# Altium project Van Battery Controller V1.PrjPCB (part 3 of 3)

## Sheet [07] - GIGAVAC.SchDoc: GIGAVAC
size 433 x 279 mm; Author: ZAG; DrawnBy: ZAG; DocumentNumber: 5; SheetNumber: 7; SheetTotal: 8; PageSetup: Record=PageOptions|CenterHorizontal=True|CenterVertical=True|PrintScale=0.96|XCorrection=1.00|YCorrection=1.00|PrintKind=2|BorderSize=5000000|LeftOffset=0|BottomOffset=0|Orientation=2|PaperLength=4318|PaperWidth=2794|Scale=100|PaperSource=15|PrintQuality=600|MediaType=1|DitherType=10|PaperKind=11x17|PrintScaleMode=1; PCBRevision: 01; SchRevision: 01; Project: VAN BATT CTRLR V1; SchStatus: PRELIM
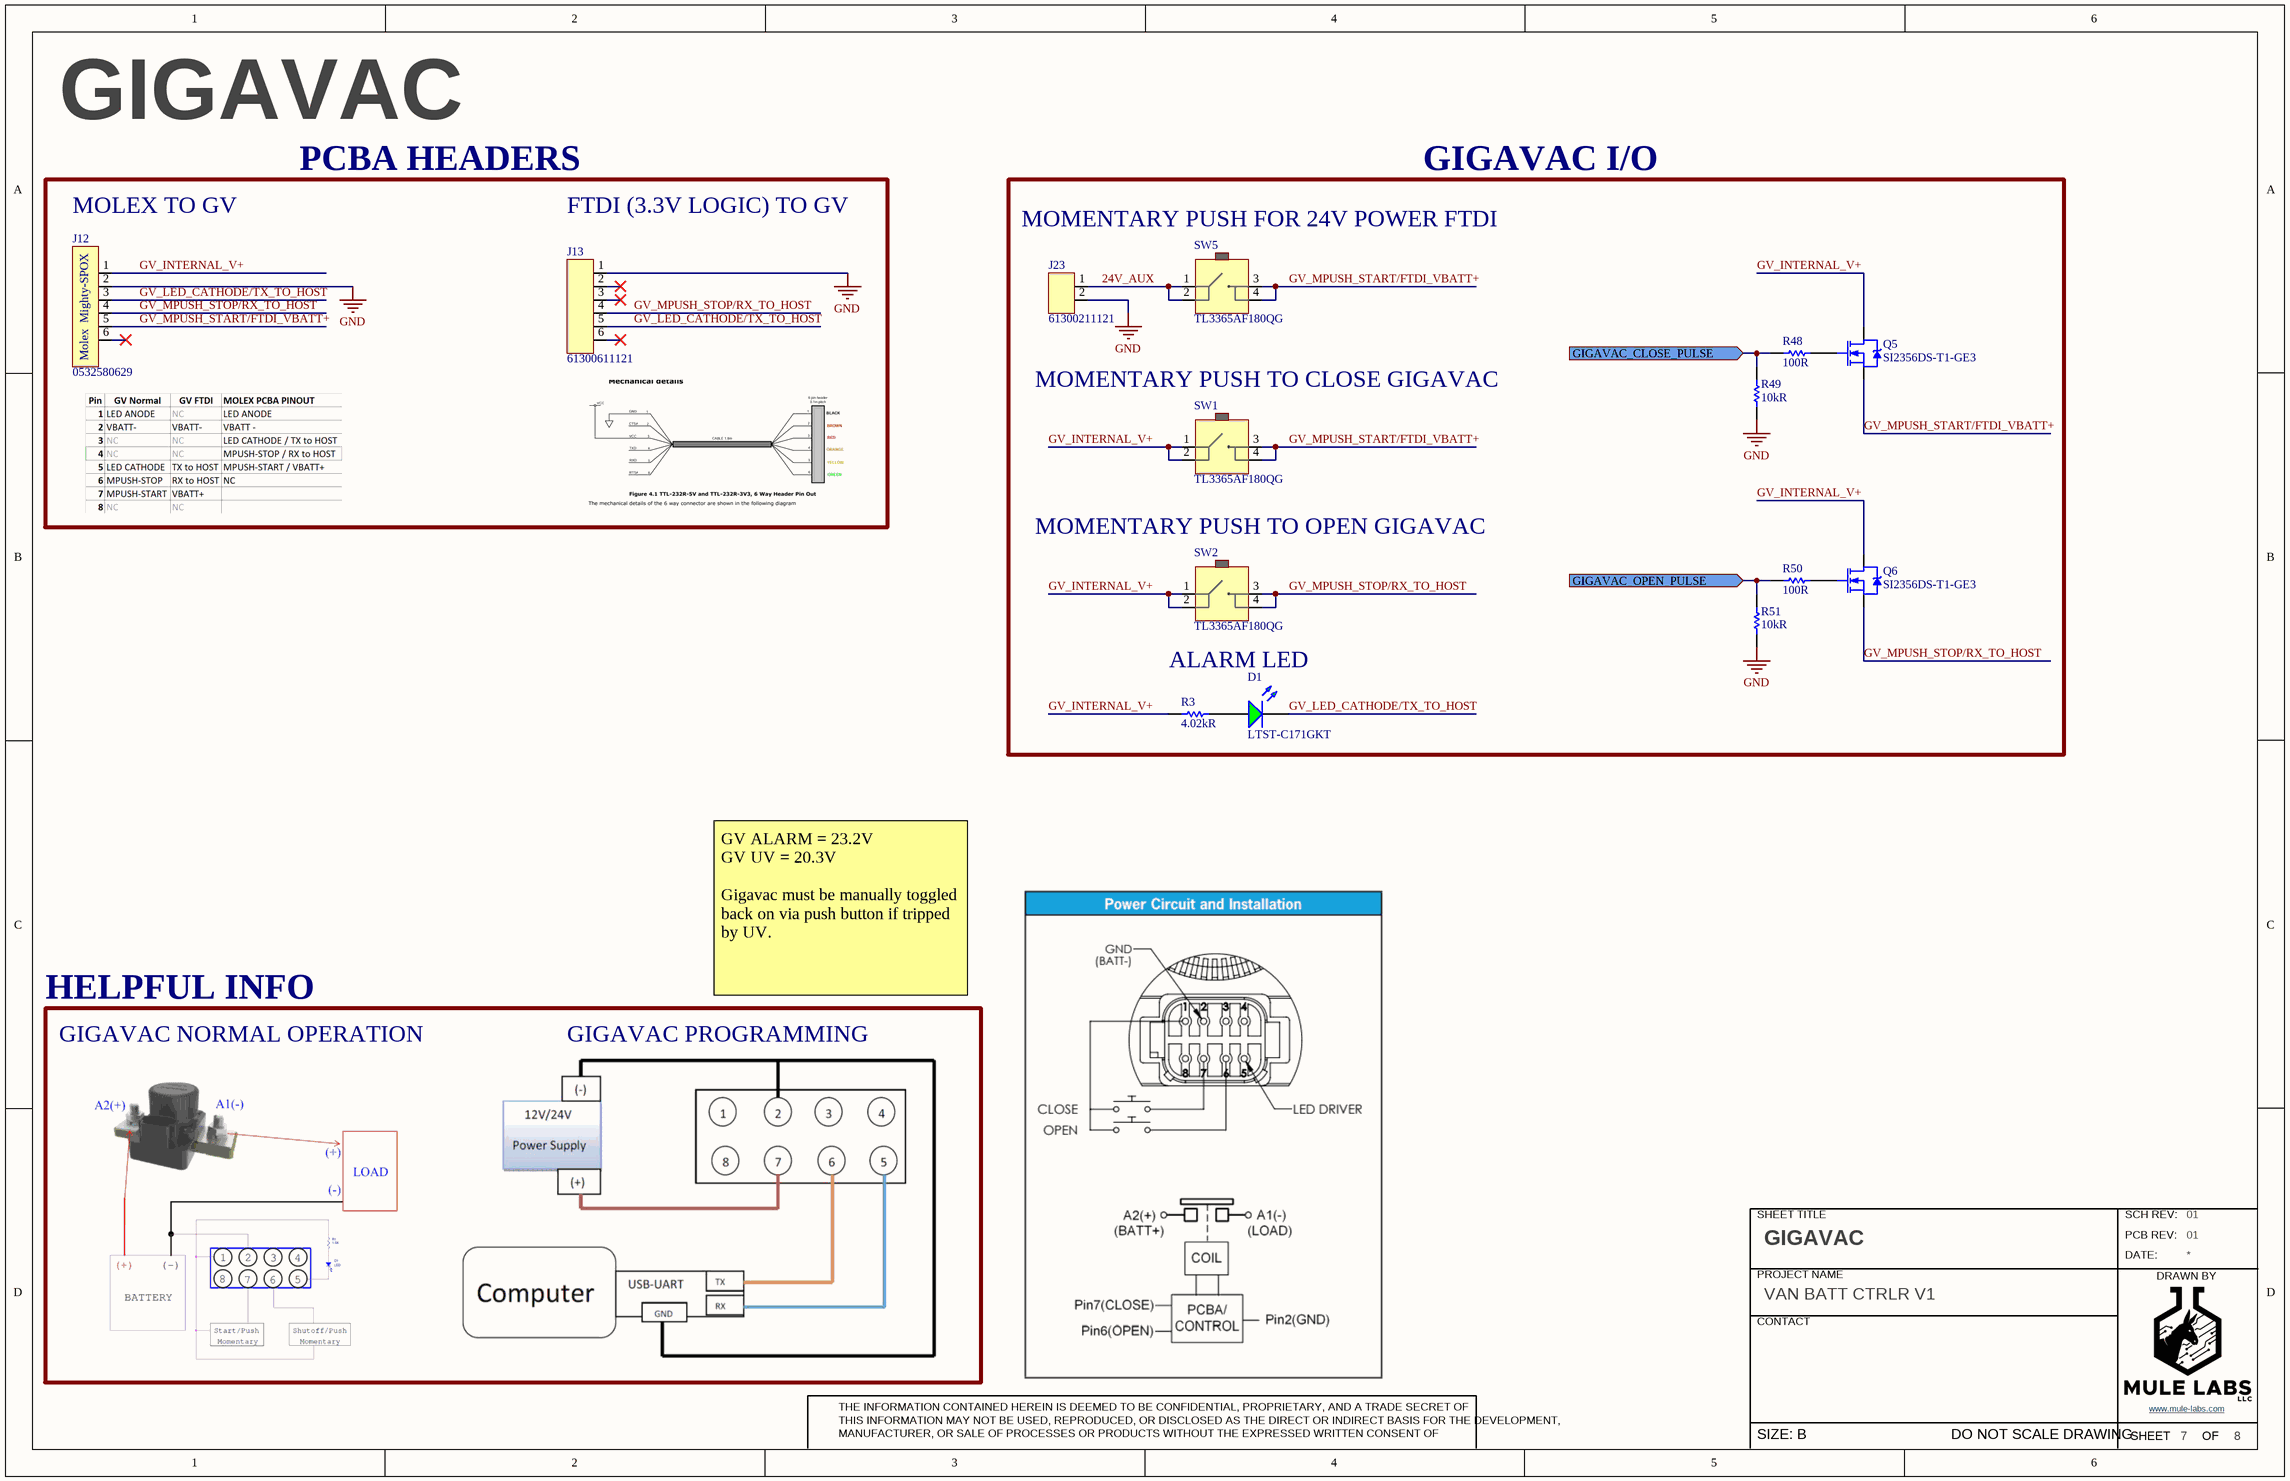
[diagram p6: [07] - GIGAVAC.SchDoc]

### Parts
D1  LTST-C171GKT  [LED - 0805 - GREEN]
J12  0532580629  [MOLEX_532580629]
J13  61300611121  [WURTH_61300611121]
J23  61300211121  [WURTH_61300211121]
Q5  SI2356DS-T1-GE3  [SOT23-3P95_237X112L50X42N]
Q6  SI2356DS-T1-GE3  [SOT23-3P95_237X112L50X42N]
R3  4.02kR  [INCH 0805 - METRIC 2012 - H065]
R48  100R  [INCH 0603 - METRIC 1608 - H055]
R49  10kR  [INCH 0603 - METRIC 1508 - H050]
R50  100R  [INCH 0603 - METRIC 1608 - H055]
R51  10kR  [INCH 0603 - METRIC 1508 - H050]
SW1  TL3365AF180QG  [ESWITCH_TL3365AF180QG]
SW2  TL3365AF180QG  [ESWITCH_TL3365AF180QG]
SW5  TL3365AF180QG  [ESWITCH_TL3365AF180QG]

### Blocks framed on the sheet
PCBA HEADERS: J12 J13
GIGAVAC I/O: D1 J23 Q5 Q6 R3 R48-R51 SW1 SW2 SW5

### Ports
GIGAVAC_CLOSE_PULSE (in), GIGAVAC_OPEN_PULSE (in)

### Nets
GND: J12.2 J13.1 J23.2 R49.1 R51.1
24V_AUX: J23.1 SW5.1 SW5.2
GIGAVAC_CLOSE_PULSE: R48.1 R49.2 ; port GIGAVAC_CLOSE_PULSE
GIGAVAC_OPEN_PULSE: R50.1 R51.2 ; port GIGAVAC_OPEN_PULSE
GV_INTERNAL_V+: J12.1 Q5.3(D) Q6.3(D) R3.1 SW1.1 SW1.2 SW2.1 SW2.2
GV_LED_CATHODE/TX_TO_HOST: D1.C J12.3 J13.5
GV_MPUSH_START/FTDI_VBATT+: J12.5 Q5.2(S) SW1.3 SW1.4 SW5.3 SW5.4
GV_MPUSH_STOP/RX_TO_HOST: J12.4 J13.4 Q6.2(S) SW2.3 SW2.4
NetD1_A: D1.A R3.2
NetQ5_1: Q5.1(G) R48.2
NetQ6_1: Q6.1(G) R50.2

Not connected (* = marked no-connect by the designer): J12 6*; J13 2* 3* 6*

### Notes on the sheet
- MOLEX TO GV
- FTDI (3.3V LOGIC) TO GV
- MOMENTARY PUSH FOR 24V POWER FTDI
- MOMENTARY PUSH TO CLOSE GIGAVAC
- MOMENTARY PUSH TO OPEN GIGAVAC
- ALARM LED
- HELPFUL INFO
- GV ALARM = 23.2V
  GV UV = 20.3V
  Gigavac must be manually toggled back on via push button if tripped by UV.
- GIGAVAC NORMAL OPERATION
- GIGAVAC PROGRAMMING
- SHEET TITLE
- SCH REV:
- PROJECT NAME
- PCB REV:
- DATE:
- DRAWN BY
- CONTACT
- MANUFACTURER, OR SALE OF PROCESSES OR PRODUCTS WITHOUT THE EXPRESSED WRITTEN CONSENT OF
- THE INFORMATION CONTAINED HEREIN IS DEEMED TO BE CONFIDENTIAL, PROPRIETARY, AND A TRADE SECRET OF
- THIS INFORMATION MAY NOT BE USED, REPRODUCED, OR DISCLOSED AS THE DIRECT OR INDIRECT BASIS FOR THE DEVELOPMENT,
- SHEET
- www.mule-labs.com <http://www.mule-labs.com>
- OF
- SIZE: B
- DO NOT SCALE DRAWING
- (in symbol 0532580629) Molex  Mighty-SPOX

### Library data of the parts
D1 = LTST-C171GKT: Lite-On LTST-C171GKT, CHIPLED 0805 Series Green LED, 569 nm 2012 (0805), Rectangle Lens SMD package; Manufacturer: Vishay Lite-On; Lens Colour: Clear,Colorless; Viewing Angle: 130°; Lens Style: Clear,Diffused,Colorless,Rectangular; Luminous Intensity: 12mcd; Forward Current: 30mA; Forward Voltage: 2.1V; Power Rating: 100mW; Dominant Wavelength: 569nm; Test Current: 10mA; Lens Transparency: Clear; Number of Elements: 1; Wavelength: 585nm; Reverse Voltage: 5V; Supplier 1: Digi-Key; Manufacturer Part Number: LTST-C171GKT; Stock 1: 271428; Pricing 1: 1=0.29, 10=0.211, 25=0.1556, 100=0.1111, 250=0.07556, 500=0.06666, 1000=0.05222 (USD); Mount: Surface Mount; Case/Package: 0805; Number of Pins: 2; Color: Green; Case Code (Metric): 2012; Case Code (Imperial): 0805; Min Operating Temperature: -55°C; Max Operating Temperature: 85°C; Package Quantity: 1; Packaging: Tape and Reel; Illumination Colour: Green; Power Dissipation: 100mW; Number of LEDs: 1; Length: 2mm; Height: 0.8mm; Width: 1.25mm; Depth: 1.25mm; Radiation Hardening: No; Lead Free: Lead Free; ComponentLink1URL: https://datasheet.ciiva.com/2110/ltst-c171gkt-2110000.pdf; ComponentLink1Description: https://datasheet.ciiva.com/2110/ltst-c171gkt-2110000.pdf; ComponentLink2URL: https://datasheet.ciiva.com/2110/ltst-c171gkt-2110001.pdf; ComponentLink2Description: https://datasheet.ciiva.com/2110/ltst-c171gkt-2110001.pdf; ComponentLink3URL: https://datasheet.ciiva.com/2110/ltst-c171gkt-2110002.pdf; ComponentLink3Description: https://datasheet.ciiva.com/2110/ltst-c171gkt-2110002.pdf; ComponentLink4URL: https://datasheet.ciiva.com/16396/ltst-c171gkt-16396549.pdf; ComponentLink4Description: https://datasheet.ciiva.com/16396/ltst-c171gkt-16396549.pdf; ComponentLink5URL: https://datasheet.ciiva.com/11773/0900766b80dc0296-11773991.pdf; ComponentLink5Description: https://datasheet.ciiva.com/11773/0900766b80dc0296-11773991.pdf; ComponentLink6URL: https://datasheet.ciiva.com/12400/lite-on-ltst-c171gkt-190133-12400647.pdf; ComponentLink6Description: https://datasheet.ciiva.com/12400/lite-on-ltst-c171gkt-190133-12400647.pdf; Supplier Part Number 1: 160-1423-1-ND; Category: LED
J12 = 0532580629: Mighty-SPOX Header, 3.50mm Pitch, Vertical, 6 Circuits, Brass (CuZn) Contact; Manufacturer: Molex; Contact Resistance: 10mR; Number of Positions: 6; Max Voltage Rating (AC): 250V; Connector Type: Male Pin; Pitch: 3.5mm; Supplier 1: Digi-Key; Manufacturer Part Number: 0532580629; RoHS: Yes; Category: Headers and Wire Housings; Stock 1: 6430; Pricing 1: 1=1.47000, 10=1.25600, 80=1.03738, 945=0.81901, 4900=0.72800 (USD); Mount: Through Hole; Contact Plating: Tin,Copper; Contact Material: Brass; Housing Material: Polyester; Color: Natural; Housing Color: Natural; Min Operating Temperature: -40°C; Max Operating Temperature: 105°C; Number of Rows: 1; Packaging: Tray; Termination: Solder; Number of Contacts: 6; Orientation: Straight; Series: 53258; Fastening Type: Latch; Contact Type: Male Pin; Length: 23.1mm; Radiation Hardening: No; Lead Free: Lead Free; ComponentLink1URL: https://datasheet.ciiva.com/737/532580229-sd-737999.pdf?src-supplier=Digi-Key; ComponentLink1Description: https://datasheet.ciiva.com/737/532580229-sd-737999.pdf?src-supplier=Digi-Key; ComponentLink2URL: https://datasheet.ciiva.com/10086/0532580629-pcb-headers-10086507.pdf?src-supplier=Avnet; ComponentLink2Description: https://datasheet.ciiva.com/10086/0532580629-pcb-headers-10086507.pdf?src-supplier=Avnet; Supplier Part Number 1: WM3416-ND
J13 = 61300611121: CONN HEADER 6 POS 2.54; Manufacturer: Wurth Electronics; Current Rating: 3A; Voltage Rating: 250V; Number of Positions: 6; Gender: Male; Connector Type: Male Pin; Pitch: 0.1inch; Supplier 1: Digi-Key; Manufacturer Part Number: 61300611121; Stock 1: 22694; Pricing 1: 1=0.33, 10=0.279, 25=0.232, 50=0.194, 100=0.176, 1000=0.16 (USD); Mount: Through Hole; Contact Plating: Gold; Contact Material: Copper,Copper Alloy; Housing Material: PBT; Color: Black; Min Operating Temperature: -40°C; Max Operating Temperature: 125°C; Number of Rows: 1; Contact Gender: Male; Packaging: Bulk; Termination: Through Hole; Number of Contacts: 6; Contact Mating Length: 0.236inch; REACH SVHC: Unknown; Lead Free: Lead Free; Supplier Part Number 1: 732-5319-ND
J23 = 61300211121: CONN HEADER 2 POS 2.54; Manufacturer: Wurth Electronics; Current Rating: 3A; Voltage Rating: 250V; Number of Positions: 2; Gender: Male; Connector Type: Male Pin; Pitch: 0.1inch; Supplier 1: Digi-Key; Manufacturer Part Number: 61300211121; Stock 1: 260997; Pricing 1: 1=0.13, 10=0.106, 25=0.088, 50=0.074, 100=0.067, 1000=0.061 (USD); Mount: Through Hole; Contact Plating: Gold; Housing Material: PBT; Contact Material: Copper,Copper Alloy; Colour: Black; Min Operating Temperature: -40°C; Max Operating Temperature: 125°C; Number of Rows: 1; Contact Gender: Male; Packaging: Bulk; Termination: Through Hole; Number of Contacts: 2; Contact Mating Length: 0.236inch; REACH SVHC: Unknown; Lead Free: Lead Free; ComponentLink1URL: http://www.mouser.com/ds/2/445/6130xx11121-538006.pdf; ComponentLink1Description: http://www.mouser.com/ds/2/445/6130xx11121-538006.pdf; Supplier Part Number 1: 732-5315-ND
Q5 Q6 = SI2356DS-T1-GE3: Si2356DS Series 40 V 3.2 A 51 mOhm Surface Mount N-Channel Mosfet - SOT-23-3; Manufacturer: Vishay Siliconix; Rds On Max: 51mR; Input Capacitance: 370pF; Rise Time: 52ns; Drain to Source Voltage (Vdss): 40V; Continuous Drain Current (ID): 4.3A; Max Power Dissipation: 1.7W; Gate to Source Voltage (Vgs): 12V; Drain to Source Resistance: 56mR; Fall Time: 53ns; Turn-Off Delay Time: 18ns; Threshold Voltage: 1.5V; Element Configuration: Single; Number of Channels: 1; Turn-On Delay Time: 10ns; Supplier 1: Digi-Key; Manufacturer Part Number: SI2356DS-T1-GE3; RoHS: Yes; Category: MOSFETs; Stock 1: 50; Pricing 1: 1=0.42000, 10=0.34200, 100=0.23300, 500=0.17476, 1000=0.13108 (USD); Mount: Surface Mount; Case/Package: TO-236-3; Number of Pins: 3; Weight: 0.050717oz; Min Operating Temperature: -55°C; Max Operating Temperature: 150°C; Packaging: Tape and Reel; Package Quantity: 3000; Drain to Source Breakdown Voltage: 40V; REACH SVHC: No SVHC; Lead Free: Lead Free; RoHS Compliant: Yes; ComponentLink1URL: https://datasheet.ciiva.com/29755/si2356ds-29755664.pdf?src-supplier=Digi-Key; ComponentLink1Description: https://datasheet.ciiva.com/29755/si2356ds-29755664.pdf?src-supplier=Digi-Key; ComponentLink2URL: https://datasheet.ciiva.com/24111/si2356ds-268760-24111179.pdf?src-supplier=Mouser; ComponentLink2Description: https://datasheet.ciiva.com/24111/si2356ds-268760-24111179.pdf?src-supplier=Mouser; ComponentLink3URL: https://datasheet.ciiva.com/29755/si2356ds-29755653.pdf?src-supplier=Digi-Key; ComponentLink3Description: https://datasheet.ciiva.com/29755/si2356ds-29755653.pdf?src-supplier=Digi-Key; ComponentLink4URL: https://datasheet.ciiva.com/29755/si2356ds-29755658.pdf?src-supplier=Digi-Key; ComponentLink4Description: https://datasheet.ciiva.com/29755/si2356ds-29755658.pdf?src-supplier=Digi-Key; Supplier Part Number 1: SI2356DS-T1-GE3CT-ND
R3 = RMCF0805FT4K02: RES 4.02K OHM 1% 1/8W 0805; Manufacturer: Stackpole Electronics; Max Power Dissipation: 125mW; Temperature Coefficient: 100ppm/°C; Supplier 1: Digi-Key; Manufacturer Part Number: RMCF0805FT4K02; RoHS: Yes; Category: Chip SMD Resistors; Stock 1: 219640; Pricing 1: 1=0.10000, 10=0.02500, 100=0.01000, 1000=0.00449, 2500=0.00390 (USD); Mount: Surface Mount; Case/Package: 0805; Case Code (Metric): 2012; Case Code (Imperial): 0805; Contact Plating: Tin,Matte; Min Operating Temperature: -55°C; Max Operating Temperature: 155°C; Resistance: 4.02kR; Tolerance: 1%; Packaging: Tape and Reel; Resistor Type: Thick Film; Number of Terminations: 2; Features: Automotive AEC-Q200; Series: RMCF; Length: 0.079inch; Width: 0.049inch; Height: 0.026inch; Radiation Hardening: No; RoHS Compliant: Yes; ComponentLink1URL: http://components.arrow.com/part/dataview/44988052S7077149N1174?src-supplier=Arrow+Electronics; ComponentLink1Description: http://components.arrow.com/part/dataview/44988052S7077149N1174?src-supplier=Arrow+Electronics; ComponentLink2URL: https://www.seielect.com/catalog/SEI-RMCF_RMCP.pdf?src-supplier=Avnet; ComponentLink2Description: https://www.seielect.com/catalog/SEI-RMCF_RMCP.pdf?src-supplier=Avnet; ComponentLink3URL: https://www.seielect.com/catalog/SEI-Packaging.pdf?src-supplier=Digi-Key; ComponentLink3Description: https://www.seielect.com/catalog/SEI-Packaging.pdf?src-supplier=Digi-Key; ComponentLink4URL: https://www.seielect.com/Catalog/SEI-RMCF_RMCP.pdf?src-supplier=Digi-Key; ComponentLink4Description: https://www.seielect.com/Catalog/SEI-RMCF_RMCP.pdf?src-supplier=Digi-Key; Supplier Part Number 1: RMCF0805FT4K02DKR-ND
R48 R50 = CPF0603B100RE1: RES SMD 100 OHM 0.1% 1/16W 0603; Manufacturer: TE Connectivity Neohm; Temperature Coefficient: 25ppm/°C; Power Rating: 63mW; Voltage Rating: 50V; Number of Resistors: 1; Supplier 1: Digi-Key; Manufacturer Part Number: CPF0603B100RE1; RoHS: Yes; Category: Chip SMD Resistors; Stock: 7060; Pricing: 1=0.65000, 10=0.46300, 100=0.24080 (USD); Mount: Surface Mount; Case/Package: 0603; Number of Pins: 2; Weight: 7.1E-05oz; Case Code (Imperial): 0603; Case Code (Metric): 1608; Min Operating Temperature: -55°C; Max Operating Temperature: 155°C; Resistance: 100R; Tolerance: 0.1%; Packaging: Tape and Reel; Package Quantity: 1000; Composition: Thin Film; Number of Terminations: 2; Termination: Solder; Voltage Rating (DC): 50V; Length: 1.55mm; Height: 0.45mm; Width: 0.8mm; REACH SVHC: No SVHC; ELV: Compliant; ComponentLink1URL: https://datasheet.ciiva.com/6767/1652074-6767153.pdf?src-supplier=Newark; ComponentLink1Description: https://datasheet.ciiva.com/6767/1652074-6767153.pdf?src-supplier=Newark; ComponentLink2URL: https://datasheet.ciiva.com/6116/eng-ds-1773200-j-6116235.pdf?src-supplier=Farnell; ComponentLink2Description: https://datasheet.ciiva.com/6116/eng-ds-1773200-j-6116235.pdf?src-supplier=Farnell; ComponentLink3URL: https://datasheet.ciiva.com/12834/eng-ds-1773200-i-12834812.pdf?src-supplier=Mouser; ComponentLink3Description: https://datasheet.ciiva.com/12834/eng-ds-1773200-i-12834812.pdf?src-supplier=Mouser; Supplier Part Number 1: A102330CT-ND
R49 R51 = RR0816P-103-D: RES SMD 10K OHM 0.5% 1/16W 0603; Manufacturer: Susumu; Power Rating: 63mW; Voltage Rating: 75V; Temperature Coefficient: 25ppm/°C; Supplier 1: Digi-Key; Manufacturer Part Number: RR0816P-103-D; Stock 1: 1106095; Pricing 1: 1=0.11, 10=0.098, 100=0.0376, 1000=0.01654, 2500=0.01428 (USD); Case/Package: 0603; Number of Pins: 2; Weight: 7.1E-05oz; Case Code (Imperial): 0603; Case Code (Metric): 1608; Min Operating Temperature: -55°C; Max Operating Temperature: 125°C; Packaging: Tape and Reel; Resistance: 10kR; Tolerance: 0.5%; Package Quantity: 1; Termination: SMD/SMT; Composition: Thin Film; Number of Terminations: 2; Max Power Dissipation: 63mW; Voltage Rating (DC): 75V; Length: 1.6mm; Height: 0.4mm; Width: 0.8mm; Depth: 0.8mm; REACH SVHC: Unknown; Lead Free: Lead Free; ComponentLink1URL: https://datasheet.ciiva.com/11820/0900766b80808d64-11820656.pdf; ComponentLink1Description: https://datasheet.ciiva.com/11820/0900766b80808d64-11820656.pdf; ComponentLink2URL: https://datasheet.ciiva.com/2487/rr-data-sheet-2487034.pdf; ComponentLink2Description: https://datasheet.ciiva.com/2487/rr-data-sheet-2487034.pdf; ComponentLink3URL: https://datasheet.ciiva.com/2487/rr-data-sheet-2487035.pdf; ComponentLink3Description: https://datasheet.ciiva.com/2487/rr-data-sheet-2487035.pdf; ComponentLink4URL: https://datasheet.ciiva.com/2487/rr-data-sheet-2487036.pdf; ComponentLink4Description: https://datasheet.ciiva.com/2487/rr-data-sheet-2487036.pdf; Supplier Part Number 1: RR08P10.0KDCT-ND; Category: Resistor
SW1 SW2 SW5 = TL3365AF180QG: SWITCH TACTILE SPST-NO 0.05A 12V; Manufacturer: E-Switch; Mechanical Life: 100000Cycles; Illumination Type: Non-Illuminated; Operating Force: 180gf; Throw Configuration: SPST; Switch Travel: 0.2mm; Switch Function: Off-Mom; Supplier 1: Digi-Key; Manufacturer Part Number: TL3365AF180QG; Stock 1: 55347; Pricing 1: 1=0.34, 10=0.333, 25=0.3208, 50=0.3088, 100=0.297, 250=0.27324, 500=0.2376, 1000=0.20196 (USD); Mount: Surface Mount; Min Operating Temperature: -20°C; Max Operating Temperature: 70°C; Packaging: Tape and Reel; Termination: Gull Wing; Lead Free: Lead Free; Supplier Part Number 1: EG5384CT-ND

## Sheet [08] - TEMP CONTROL.SchDoc: TEMP CONTROL
size 433 x 279 mm; Author: ZAG; DrawnBy: ZAG; DocumentNumber: 5; SheetNumber: 8; SheetTotal: 8; PageSetup: Record=PageOptions|CenterHorizontal=True|CenterVertical=True|PrintScale=0.96|XCorrection=1.00|YCorrection=1.00|PrintKind=2|BorderSize=5000000|LeftOffset=0|BottomOffset=0|Orientation=2|PaperLength=4318|PaperWidth=2794|Scale=100|PaperSource=15|PrintQuality=600|MediaType=1|DitherType=10|PaperKind=11x17|PrintScaleMode=1; PCBRevision: 01; SchRevision: 01; Project: VAN BATT CTRLR V1; SchStatus: PRELIM
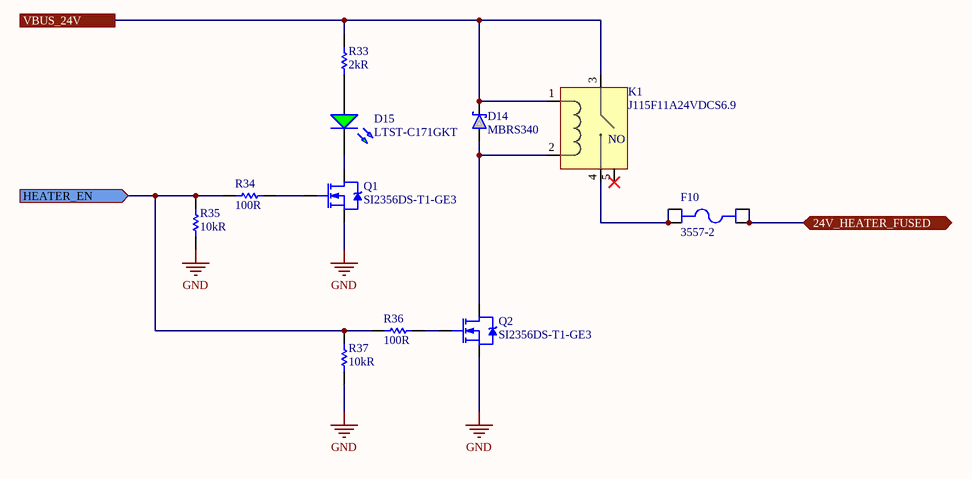
[diagram p7: [08] - TEMP CONTROL.SchDoc]

### Parts
D14  MBRS340  [D0-214AB SMC - L]
D15  LTST-C171GKT  [LED - 0805 - GREEN]
F10  3557-2  [KEYSTONE_3557-2]
K1  J115F11A24VDCS6.9  [CIT_J115F11A24VDCS6_9]
Q1  SI2356DS-T1-GE3  [SOT23-3P95_237X112L50X42N]
Q2  SI2356DS-T1-GE3  [SOT23-3P95_237X112L50X42N]
R33  2kR  [INCH 0805 - METRIC 2012 - H065]
R34  100R  [INCH 0603 - METRIC 1608 - H055]
R35  10kR  [INCH 0603 - METRIC 1508 - H050]
R36  100R  [INCH 0603 - METRIC 1608 - H055]
R37  10kR  [INCH 0603 - METRIC 1508 - H050]

### Ports
24V_HEATER_FUSED (bidir), HEATER_EN (in), VBUS_24V

### Nets
GND: Q1.2(S) Q2.2(S) R35.2 R37.2
24V_HEATER_FUSED: F10.3 F10.4 ; port 24V_HEATER_FUSED
HEATER_EN: R34.1 R35.1 R36.1 R37.1 ; port HEATER_EN
VBUS_24V: D14.1 K1.1 K1.3 R33.1 ; port VBUS_24V
NetD14_2: D14.2 K1.2 Q2.3(D)
NetD15_A: D15.A R33.2
NetD15_C: D15.C Q1.3(D)
NetF10_1: F10.1 F10.2 K1.4
NetQ1_1: Q1.1(G) R34.2
NetQ2_1: Q2.1(G) R36.2

Not connected (* = marked no-connect by the designer): K1 5*

### Notes on the sheet
- SHEET TITLE
- SCH REV:
- PROJECT NAME
- PCB REV:
- DATE:
- DRAWN BY
- CONTACT
- MANUFACTURER, OR SALE OF PROCESSES OR PRODUCTS WITHOUT THE EXPRESSED WRITTEN CONSENT OF
- THE INFORMATION CONTAINED HEREIN IS DEEMED TO BE CONFIDENTIAL, PROPRIETARY, AND A TRADE SECRET OF
- THIS INFORMATION MAY NOT BE USED, REPRODUCED, OR DISCLOSED AS THE DIRECT OR INDIRECT BASIS FOR THE DEVELOPMENT,
- SHEET
- www.mule-labs.com <http://www.mule-labs.com>
- OF
- SIZE: B
- DO NOT SCALE DRAWING
- (in symbol J115F11A24VDCS6.9) NO

### Library data of the parts
D14 = MBRS340: DIODE SCHOTTKY 40V 4A SMC; Manufacturer: ON Semiconductor / Fairchild; Element Configuration: Single; Max Surge Current: 80A; Max Reverse Leakage Current: 2mA; Polarity: Standard; Current Rating: 3A; Forward Voltage: 525mV; Supplier 1: Digi-Key; Manufacturer Part Number: MBRS340; Stock 1: 32395; Pricing 1: 1=0.65, 10=0.554, 100=0.4137, 500=0.32502, 1000=0.25115 (USD); Mount: Surface Mount; Number of Pins: 2; Weight: 0.3g; Contact Plating: Tin,Matte; Min Operating Temperature: -65°C; Max Operating Temperature: 125°C; Packaging: Tape and Reel; Average Rectified Current: 4A; Max Reverse Voltage (DC): 40V; Package Quantity: 1; Peak Non-Repetitive Surge Current: 80A; Voltage Rating (DC): 40V; Output Current: 3A; Peak Reverse Current: 2mA; Max Repetitive Reverse Voltage (Vrrm): 40V; Forward Current: 4A; Max Forward Surge Current (Ifsm): 80A; Length: 7.15mm; Height: 2.75mm; Width: 6.25mm; Radiation Hardening: No; Lead Free: Lead Free; REACH SVHC: No SVHC; ComponentLink1URL: https://datasheet.ciiva.com/22651/48013-22651968.pdf; ComponentLink1Description: https://datasheet.ciiva.com/22651/48013-22651968.pdf; ComponentLink2URL: https://datasheet.ciiva.com/4714/mbrs340-63506-4714275.pdf; ComponentLink2Description: https://datasheet.ciiva.com/4714/mbrs340-63506-4714275.pdf; ComponentLink3URL: https://datasheet.ciiva.com/8303/mbrs340-8303605.pdf; ComponentLink3Description: https://datasheet.ciiva.com/8303/mbrs340-8303605.pdf; ComponentLink4URL: https://datasheet.ciiva.com/8303/mbrs340-8303610.pdf; ComponentLink4Description: https://datasheet.ciiva.com/8303/mbrs340-8303610.pdf; ComponentLink5URL: https://datasheet.ciiva.com/30479/0900766b810e2514-30479354.pdf; ComponentLink5Description: https://datasheet.ciiva.com/30479/0900766b810e2514-30479354.pdf; ComponentLink6URL: https://datasheet.ciiva.com/911/mbrs340-911131.pdf; ComponentLink6Description: https://datasheet.ciiva.com/911/mbrs340-911131.pdf; ComponentLink7URL: https://datasheet.ciiva.com/911/mbrs340-911132.pdf; ComponentLink7Description: https://datasheet.ciiva.com/911/mbrs340-911132.pdf; ComponentLink8URL: https://datasheet.ciiva.com/911/mbrs340-911133.pdf; ComponentLink8Description: https://datasheet.ciiva.com/911/mbrs340-911133.pdf; ComponentLink9URL: https://datasheet.ciiva.com/15144/getdatasheetpartid-102412-15144829.pdf; ComponentLink9Description: https://datasheet.ciiva.com/15144/getdatasheetpartid-102412-15144829.pdf; ComponentLink10URL: https://datasheet.ciiva.com/25951/mbrs340-25951711.pdf; ComponentLink10Description: https://datasheet.ciiva.com/25951/mbrs340-25951711.pdf; ComponentLink11URL: https://datasheet.ciiva.com/26788/mbrs340-26788710.pdf; ComponentLink11Description: https://datasheet.ciiva.com/26788/mbrs340-26788710.pdf; Supplier Part Number 1: MBRS340FSCT-ND; Category: Diode
D15 = LTST-C171GKT: as D1 on sheet [07] - GIGAVAC; Supplier 1: Digi-Key; Manufacturer Part Number: LTST-C171GKT; Stock 1: 271428; Pricing 1: 1=0.29, 10=0.211, 25=0.1556, 100=0.1111, 250=0.07556, 500=0.06666, 1000=0.05222 (USD); Mount: Surface Mount; Case/Package: 0805; Number of Pins: 2; Color: Green; Case Code (Metric): 2012; Case Code (Imperial): 0805; Min Operating Temperature: -55°C; Max Operating Temperature: 85°C; Package Quantity: 1; Packaging: Tape and Reel; Illumination Colour: Green; Power Dissipation: 100mW; Number of LEDs: 1; Length: 2mm; Height: 0.8mm; Width: 1.25mm; Depth: 1.25mm; Radiation Hardening: No; Lead Free: Lead Free; ComponentLink1URL: https://datasheet.ciiva.com/2110/ltst-c171gkt-2110000.pdf; ComponentLink1Description: https://datasheet.ciiva.com/2110/ltst-c171gkt-2110000.pdf; ComponentLink2URL: https://datasheet.ciiva.com/2110/ltst-c171gkt-2110001.pdf; ComponentLink2Description: https://datasheet.ciiva.com/2110/ltst-c171gkt-2110001.pdf; ComponentLink3URL: https://datasheet.ciiva.com/2110/ltst-c171gkt-2110002.pdf; ComponentLink3Description: https://datasheet.ciiva.com/2110/ltst-c171gkt-2110002.pdf; ComponentLink4URL: https://datasheet.ciiva.com/16396/ltst-c171gkt-16396549.pdf; ComponentLink4Description: https://datasheet.ciiva.com/16396/ltst-c171gkt-16396549.pdf; ComponentLink5URL: https://datasheet.ciiva.com/11773/0900766b80dc0296-11773991.pdf; ComponentLink5Description: https://datasheet.ciiva.com/11773/0900766b80dc0296-11773991.pdf; ComponentLink6URL: https://datasheet.ciiva.com/12400/lite-on-ltst-c171gkt-190133-12400647.pdf; ComponentLink6Description: https://datasheet.ciiva.com/12400/lite-on-ltst-c171gkt-190133-12400647.pdf; Supplier Part Number 1: 160-1423-1-ND; Category: LED
F10 = 3557-2: Fuse Holder; Auto; 2 in1 Blade; THM; 1 Fuse; Vertical; 30 Amps; Manufacturer: Keystone Electronics; Color: Black; Material: Brass,Tin,Nylon; Current Rating: 20A; Voltage Rating (AC): 500V; Number of Poles: 1; Illumination Type: Illuminated; Fuse Type: Automotive; Fuse Size: ATO, ATC, or Mini ATO, ATC; Supplier 1: Digi-Key; Manufacturer Part Number: 3557-2; RoHS: Yes; Category: Fuses; Pricing 1: 1=1.22000, 25=1.01080, 100=0.92640, 250=0.84220, 500=0.75798, 1000=0.67376, 2500=0.61060, 5000=0.58954 (USD); Mount: Vertical,PCB; Contact Plating: Tin; Contact Material: Brass; Min Operating Temperature: -50°C; Max Operating Temperature: 145°C; Package Quantity: 1; Number of Circuits: 1; Termination: PC Pin; Voltage: 500V; Fuse Current: 20A; Orientation: Vertical; Series: -; Length: 19.8mm; Depth: 6.8mm; Size: 0.265inch; REACH SVHC: No SVHC; Lead Free: Lead Free; Flammability Rating: UL94 V-0; ComponentLink1URL: https://datasheet.ciiva.com/22650/1686040-22650698.pdf?src-supplier=Element14; ComponentLink1Description: https://datasheet.ciiva.com/22650/1686040-22650698.pdf?src-supplier=Element14; ComponentLink2URL: https://datasheet.ciiva.com/16369/m60-2p39-16369546.pdf?src-supplier=Future+Electronics; ComponentLink2Description: https://datasheet.ciiva.com/16369/m60-2p39-16369546.pdf?src-supplier=Future+Electronics; Supplier Part Number 1: 36-3557-2-ND
K1 = J115F11A24VDCS6.9: Manufacturer: CIT Relay & Switch; Supplier 1: Digi-Key; Manufacturer Part Number: J115F11A24VDCS6.9; RoHS: No; Stock 1: 7830; Pricing 1: 1=2.82000, 15=2.64600, 30=2.35200, 45=2.23444, 90=2.11678, 240=1.88158, 450=1.76400, 945=1.64640 (USD); Supplier Part Number 1: 2449-J115F11A24VDCS6.9-ND
Q1 Q2 = SI2356DS-T1-GE3: as Q5 on sheet [07] - GIGAVAC; Supplier 1: Digi-Key; Manufacturer Part Number: SI2356DS-T1-GE3; RoHS: Yes; Category: MOSFETs; Stock 1: 50; Pricing 1: 1=0.42000, 10=0.34200, 100=0.23300, 500=0.17476, 1000=0.13108 (USD); Mount: Surface Mount; Case/Package: TO-236-3; Number of Pins: 3; Weight: 0.050717oz; Min Operating Temperature: -55°C; Max Operating Temperature: 150°C; Packaging: Tape and Reel; Package Quantity: 3000; Drain to Source Breakdown Voltage: 40V; REACH SVHC: No SVHC; Lead Free: Lead Free; RoHS Compliant: Yes; ComponentLink1URL: https://datasheet.ciiva.com/29755/si2356ds-29755664.pdf?src-supplier=Digi-Key; ComponentLink1Description: https://datasheet.ciiva.com/29755/si2356ds-29755664.pdf?src-supplier=Digi-Key; ComponentLink2URL: https://datasheet.ciiva.com/24111/si2356ds-268760-24111179.pdf?src-supplier=Mouser; ComponentLink2Description: https://datasheet.ciiva.com/24111/si2356ds-268760-24111179.pdf?src-supplier=Mouser; ComponentLink3URL: https://datasheet.ciiva.com/29755/si2356ds-29755653.pdf?src-supplier=Digi-Key; ComponentLink3Description: https://datasheet.ciiva.com/29755/si2356ds-29755653.pdf?src-supplier=Digi-Key; ComponentLink4URL: https://datasheet.ciiva.com/29755/si2356ds-29755658.pdf?src-supplier=Digi-Key; ComponentLink4Description: https://datasheet.ciiva.com/29755/si2356ds-29755658.pdf?src-supplier=Digi-Key; Supplier Part Number 1: SI2356DS-T1-GE3CT-ND
R33 = CRCW08052K00FKEA: Res Thick Film 0805 2K Ohm 1% 1/8W ±100ppm/°C Molded SMD Paper T/R; Manufacturer: Vishay; Number of Terminals/Pins: 2; Power Rating: 125mW; Voltage Rating: 150V; Supplier 1: Digi-Key; Manufacturer Part Number: CRCW08052K00FKEA; RoHS: Yes; Category: Chip SMD Resistors; Stock: 25162; Pricing: 1=0.10000, 10=0.06500, 100=0.02660, 1000=0.01195, 2500=0.01037 (USD); Mount: Surface Mount; Case/Package: 0805; Number of Pins: 2; Contact Plating: Tin; Weight: 0.000194oz; Case Code (Imperial): 0805; Case Code (Metric): 2012; Package Shape: Rectangular; Min Operating Temperature: -55°C; Max Operating Temperature: 155°C; Tolerance: 1%; Resistance: 2kR; Resistor Type: Thick Film; Temperature Coefficient: 100ppm/°C; Packaging: Tape and Reel; Package Quantity: 10; Termination: SMD/SMT; Number of Terminations: 2; Max Power Dissipation: 125mW; Features: Automotive AEC-Q200; Technology: THICK FILM; Voltage Rating (DC): 150V; Working Voltage: 150V; Length: 2mm; Width: 1.25mm; Height: 0.02inch; Depth: 1.25mm; Radiation Hardening: No; Lead Free: Lead Free; RoHS Compliant: Yes; Military Standard: Not; REACH SVHC: Unknown; ComponentLink1URL: https://datasheet.ciiva.com/9093/dcrcwe3-9093501.pdf?src-supplier=Avnet; ComponentLink1Description: https://datasheet.ciiva.com/9093/dcrcwe3-9093501.pdf?src-supplier=Avnet; ComponentLink2URL: https://datasheet.ciiva.com/2467/dcrcwe3-2467164.pdf?src-supplier=Digi-Key; ComponentLink2Description: https://datasheet.ciiva.com/2467/dcrcwe3-2467164.pdf?src-supplier=Digi-Key; ComponentLink3URL: https://datasheet.ciiva.com/2467/dcrcwe3-2467165.pdf?src-supplier=Digi-Key; ComponentLink3Description: https://datasheet.ciiva.com/2467/dcrcwe3-2467165.pdf?src-supplier=Digi-Key; ComponentLink4URL: https://datasheet.ciiva.com/2467/dcrcwe3-2467166.pdf?src-supplier=Digi-Key; ComponentLink4Description: https://datasheet.ciiva.com/2467/dcrcwe3-2467166.pdf?src-supplier=Digi-Key; ComponentLink5URL: https://datasheet.ciiva.com/5547/dcrcwe3-109170-5547611.pdf?src-supplier=Mouser; ComponentLink5Description: https://datasheet.ciiva.com/5547/dcrcwe3-109170-5547611.pdf?src-supplier=Mouser; ComponentLink6URL: https://datasheet.ciiva.com/16199/dcrcwe3-16199147.pdf?src-supplier=Future+Electronics; ComponentLink6Description: https://datasheet.ciiva.com/16199/dcrcwe3-16199147.pdf?src-supplier=Future+Electronics; ComponentLink7URL: https://datasheet.ciiva.com/15158/getdatasheetpartid-246953-15158870.pdf?src-supplier=Verical; ComponentLink7Description: https://datasheet.ciiva.com/15158/getdatasheetpartid-246953-15158870.pdf?src-supplier=Verical; ComponentLink8URL: https://datasheet.ciiva.com/7673/1720486-7673483.pdf?src-supplier=Element14; ComponentLink8Description: https://datasheet.ciiva.com/7673/1720486-7673483.pdf?src-supplier=Element14; ComponentLink9URL: https://datasheet.ciiva.com/17202/dcrcwe3-17202695.pdf?src-supplier=Avnet+Europe; ComponentLink9Description: https://datasheet.ciiva.com/17202/dcrcwe3-17202695.pdf?src-supplier=Avnet+Europe; ComponentLink10URL: https://datasheet.ciiva.com/16772/70201119-16772086.pdf?src-supplier=Allied+Electronics; ComponentLink10Description: https://datasheet.ciiva.com/16772/70201119-16772086.pdf?src-supplier=Allied+Electronics; ComponentLink11URL: https://datasheet.ciiva.com/7673/1697337-7673343.pdf?src-supplier=Element14; ComponentLink11Description: https://datasheet.ciiva.com/7673/1697337-7673343.pdf?src-supplier=Element14; ComponentLink12URL: https://datasheet.ciiva.com/7673/1720486-7673482.pdf?src-supplier=Element14; ComponentLink12Description: https://datasheet.ciiva.com/7673/1720486-7673482.pdf?src-supplier=Element14; Supplier Part Number 1: 541-2.00KCCT-ND
R34 R36 = CPF0603B100RE1: as R48 on sheet [07] - GIGAVAC; Supplier 1: Digi-Key; Manufacturer Part Number: CPF0603B100RE1; RoHS: Yes; Category: Chip SMD Resistors; Stock: 7060; Pricing: 1=0.65000, 10=0.46300, 100=0.24080 (USD); Mount: Surface Mount; Case/Package: 0603; Number of Pins: 2; Weight: 7.1E-05oz; Case Code (Imperial): 0603; Case Code (Metric): 1608; Min Operating Temperature: -55°C; Max Operating Temperature: 155°C; Resistance: 100R; Tolerance: 0.1%; Packaging: Tape and Reel; Package Quantity: 1000; Composition: Thin Film; Number of Terminations: 2; Termination: Solder; Voltage Rating (DC): 50V; Length: 1.55mm; Height: 0.45mm; Width: 0.8mm; REACH SVHC: No SVHC; ELV: Compliant; ComponentLink1URL: https://datasheet.ciiva.com/6767/1652074-6767153.pdf?src-supplier=Newark; ComponentLink1Description: https://datasheet.ciiva.com/6767/1652074-6767153.pdf?src-supplier=Newark; ComponentLink2URL: https://datasheet.ciiva.com/6116/eng-ds-1773200-j-6116235.pdf?src-supplier=Farnell; ComponentLink2Description: https://datasheet.ciiva.com/6116/eng-ds-1773200-j-6116235.pdf?src-supplier=Farnell; ComponentLink3URL: https://datasheet.ciiva.com/12834/eng-ds-1773200-i-12834812.pdf?src-supplier=Mouser; ComponentLink3Description: https://datasheet.ciiva.com/12834/eng-ds-1773200-i-12834812.pdf?src-supplier=Mouser; Supplier Part Number 1: A102330CT-ND
R35 R37 = CRCW060310K0JNEA: RES SMD 10K OHM 5% 1/10W 0603; Manufacturer: Vishay Dale; Temperature Coefficient: 200ppm/°C; Max Power Dissipation: 100mW; Voltage Rating: 75V; Supplier 1: Digi-Key; Manufacturer Part Number: CRCW060310K0JNEA; RoHS: Yes; Category: Chip SMD Resistors; Stock 1: 5423; Pricing 1: 1=0.10000, 10=0.03100, 100=0.01250, 1000=0.00563, 2500=0.00488 (USD); Mount: Surface Mount; Case/Package: 0603; Number of Pins: 2; Case Code (Metric): 1608; Case Code (Imperial): 0603; Contact Plating: Tin; Weight: 7.1E-05oz; Size Code: 0603; Min Operating Temperature: -55°C; Max Operating Temperature: 155°C; Resistance: 10kR; Tolerance: 5%; Resistor Type: Thick Film; Packaging: Tape and Reel; Number of Terminations: 2; Package Quantity: 1; Power Rating: 100mW; Termination: SMD/SMT; Features: Automotive AEC-Q200; Voltage Rating (DC): 75V; Series: CRCW; Construction: Rectangular; Resistance Tolerance: 5%; Length: 1.55mm; Width: 0.033inch; Height: 0.02inch; Depth: 0.85mm; Radiation Hardening: No; Lead Free: Lead Free; RoHS Compliant: Yes; REACH SVHC: Unknown; Military Standard: Not; ComponentLink1URL: https://datasheet.ciiva.com/2461/dcrcwe3-2461971.pdf?src-supplier=Digi-Key; ComponentLink1Description: https://datasheet.ciiva.com/2461/dcrcwe3-2461971.pdf?src-supplier=Digi-Key; ComponentLink2URL: https://datasheet.ciiva.com/2461/dcrcwe3-2461972.pdf?src-supplier=Digi-Key; ComponentLink2Description: https://datasheet.ciiva.com/2461/dcrcwe3-2461972.pdf?src-supplier=Digi-Key; ComponentLink3URL: https://datasheet.ciiva.com/2461/dcrcwe3-2461973.pdf?src-supplier=Digi-Key; ComponentLink3Description: https://datasheet.ciiva.com/2461/dcrcwe3-2461973.pdf?src-supplier=Digi-Key; ComponentLink4URL: https://datasheet.ciiva.com/16343/dcrcwe3-16343525.pdf?src-supplier=Future+Electronics; ComponentLink4Description: https://datasheet.ciiva.com/16343/dcrcwe3-16343525.pdf?src-supplier=Future+Electronics; ComponentLink5URL: https://datasheet.ciiva.com/16755/70201119-16755717.pdf?src-supplier=Allied+Electronics; ComponentLink5Description: https://datasheet.ciiva.com/16755/70201119-16755717.pdf?src-supplier=Allied+Electronics; ComponentLink6URL: https://datasheet.ciiva.com/16771/70201119-16771051.pdf?src-supplier=Allied+Electronics; ComponentLink6Description: https://datasheet.ciiva.com/16771/70201119-16771051.pdf?src-supplier=Allied+Electronics; ComponentLink7URL: https://datasheet.ciiva.com/16515/dcrcwe3-16515020.pdf?src-supplier=Avnet+Asia; ComponentLink7Description: https://datasheet.ciiva.com/16515/dcrcwe3-16515020.pdf?src-supplier=Avnet+Asia; ComponentLink8URL: https://datasheet.ciiva.com/3256/dcrcwe3-3256942.pdf?src-supplier=Avnet; ComponentLink8Description: https://datasheet.ciiva.com/3256/dcrcwe3-3256942.pdf?src-supplier=Avnet; ComponentLink9URL: https://datasheet.ciiva.com/3256/dcrcwe3-3256943.pdf?src-supplier=Avnet; ComponentLink9Description: https://datasheet.ciiva.com/3256/dcrcwe3-3256943.pdf?src-supplier=Avnet; Supplier Part Number 1: 541-10KGCT-ND

## Nets that join several sheets
3V3: [03] - VOLTAGE REGULATION (C12.2 D2.A U2.6), [04] - MICROCONTROLLER (12 pins), [05] - BMS (NTC1.2 NTC2.2 OP1.1 OP2.1)
GND: [02] - CONNECTORS (59 pins), [03] - VOLTAGE REGULATION (5 pins), [04] - MICROCONTROLLER (24 pins), [05] - BMS (13 pins), [06] - FUSES (24 pins), [07] - GIGAVAC (5 pins), [08] - TEMP CONTROL (Q1.2 Q2.2 R35.2 R37.2)
24V_HEATER_FUSED: [02] - CONNECTORS (J22.1), [08] - TEMP CONTROL (F10.3 F10.4)
30A_CKT1_FUSE_DETECT: [04] - MICROCONTROLLER (U1.15), [06] - FUSES (C13.2 R7.1 R9.2)
30A_CKT1_FUSE_LED: [04] - MICROCONTROLLER (U1.29), [06] - FUSES (R23.1)
30A_CKT2_FUSE_DETECT: [04] - MICROCONTROLLER (U1.14), [06] - FUSES (C15.2 R11.1 R13.2)
30A_CKT2_FUSE_LED: [04] - MICROCONTROLLER (U1.30), [06] - FUSES (R25.1)
30A_CKT3_FUSE_DETECT: [04] - MICROCONTROLLER (U1.13), [06] - FUSES (C17.2 R15.1 R17.2)
30A_CKT3_FUSE_LED: [04] - MICROCONTROLLER (U1.31), [06] - FUSES (R27.1)
30A_CKT4_FUSE_DETECT: [04] - MICROCONTROLLER (U1.12), [06] - FUSES (C19.2 R19.1 R21.2)
30A_CKT4_FUSE_LED: [04] - MICROCONTROLLER (U1.32), [06] - FUSES (R29.1)
30A_CKT5_FUSE_DETECT: [04] - MICROCONTROLLER (U1.11), [06] - FUSES (C14.2 R8.1 R10.2)
30A_CKT5_FUSE_LED: [04] - MICROCONTROLLER (U1.33), [06] - FUSES (R24.1)
30A_CKT6_FUSE_DETECT: [04] - MICROCONTROLLER (U1.10), [06] - FUSES (C16.2 R12.1 R14.2)
30A_CKT6_FUSE_LED: [04] - MICROCONTROLLER (U1.38), [06] - FUSES (R26.1)
30A_CKT_1_FUSED: [02] - CONNECTORS (J3.1), [06] - FUSES (F1.3 F1.4 R7.2)
30A_CKT_2_FUSED: [02] - CONNECTORS (J4.1), [06] - FUSES (F2.3 F2.4 R11.2)
30A_CKT_3_FUSED: [02] - CONNECTORS (J5.1), [06] - FUSES (F3.3 F3.4 R15.2)
30A_CKT_4_FUSED: [02] - CONNECTORS (J6.1), [06] - FUSES (F4.3 F4.4 R19.2)
30A_CKT_5_FUSED: [02] - CONNECTORS (J7.1), [06] - FUSES (F5.3 F5.4 R8.2)
30A_CKT_6_FUSED: [02] - CONNECTORS (J8.1), [06] - FUSES (F6.3 F6.4 R12.2)
60A_CKT1_FUSE_DETECT: [04] - MICROCONTROLLER (U1.17), [06] - FUSES (C18.2 R16.1 R18.2)
60A_CKT1_FUSE_LED: [04] - MICROCONTROLLER (U1.19), [06] - FUSES (R28.1)
60A_CKT2_FUSE_DETECT: [04] - MICROCONTROLLER (U1.16), [06] - FUSES (C20.2 R20.1 R22.2)
60A_CKT2_FUSE_LED: [04] - MICROCONTROLLER (U1.20), [06] - FUSES (R30.1)
60A_CKT_1_FUSED: [02] - CONNECTORS (12 pins), [06] - FUSES (F7.3 F7.4 R16.2)
60A_CKT_2_FUSED: [02] - CONNECTORS (12 pins), [06] - FUSES (F8.3 F8.4 R20.2)
CHG_SHNT_N: [05] - BMS (J16.7), [06] - FUSES (NT3.1)
CHG_SHNT_P: [05] - BMS (J16.8), [06] - FUSES (NT4.1)
DSCHG_SHNT_N: [02] - CONNECTORS (NT2.1), [05] - BMS (J16.1)
DSCHG_SHNT_P: [02] - CONNECTORS (NT1.1), [05] - BMS (J16.2)
GIGAVAC_CLOSE_PULSE: [04] - MICROCONTROLLER (U1.25), [07] - GIGAVAC (R48.1 R49.2)
GIGAVAC_OPEN_PULSE: [04] - MICROCONTROLLER (U1.26), [07] - GIGAVAC (R50.1 R51.2)
HEATER_EN: [04] - MICROCONTROLLER (U1.2), [08] - TEMP CONTROL (R34.1 R35.1 R36.1 R37.1)
OV_DIGITAL_IN: [04] - MICROCONTROLLER (U1.4), [05] - BMS (R39.1 R41.2)
OV_INDICATE_LED: [04] - MICROCONTROLLER (U1.46), [05] - BMS (R47.1)
OV_TO_CHARGER: [04] - MICROCONTROLLER (U1.22), [05] - BMS (R43.1 R45.2)
SOLAR_IN: [02] - CONNECTORS (12 pins), [06] - FUSES (F9.3 F9.4)
THERMISTOR_PCBA_ISOALTED: [04] - MICROCONTROLLER (U1.27), [05] - BMS (C22.2 NTC2.1 R54.2)
THERMISTOR_PCBA_SHUNTS: [04] - MICROCONTROLLER (U1.28), [05] - BMS (C21.2 NTC1.1 R52.2)
UV_DIGITAL_IN: [04] - MICROCONTROLLER (U1.3), [05] - BMS (R38.1 R40.2)
UV_INDICATE_LED: [04] - MICROCONTROLLER (U1.45), [05] - BMS (R46.1)
UV_TO_INVERTER: [04] - MICROCONTROLLER (U1.21), [05] - BMS (R42.1 R44.2)
VBUS_24V: [02] - CONNECTORS (NT2.2 R1.1), [03] - VOLTAGE REGULATION (D3.2), [05] - BMS (NT5.2 NT6.2), [06] - FUSES (18 pins), [08] - TEMP CONTROL (D14.1 K1.1 K1.3 R33.1)

## Assembly variants
ORIGINAL: all parts fitted